# EAGLE design supply (EAGLE 7.2.0)
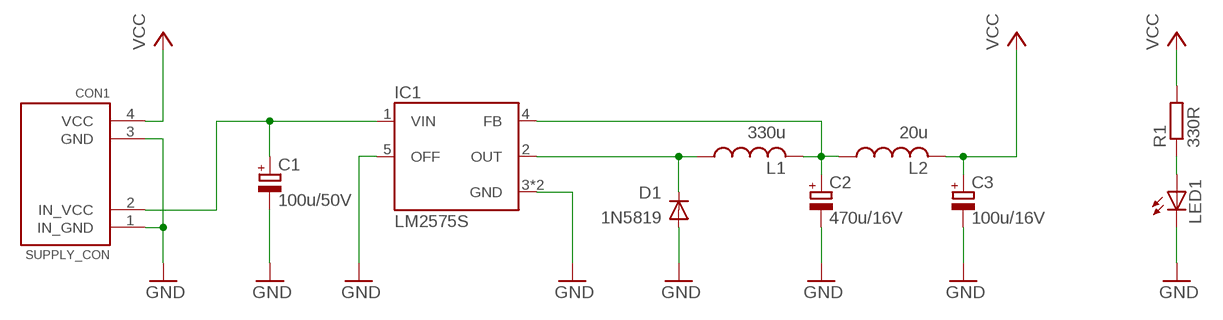
[diagram p0: schematic, sheet 1]

## Parts
C1  100u/50V  CPOL-EUE3.5-8  [E3,5-8]
C2  470u/16V  CPOL-EUE5-10.5  [E5-10,5]
C3  100u/16V  CPOL-EUE2.5-6  [E2,5-6]
CON1  SUPPLY_CON  [SUPPLY_CON]
D1  1N5819  1N4004  [DO41-10]
IC1  LM2575S  [TO263-5]
L1  330u  COIL  [COIL]
L2  20u  COIL  [COIL]
LED1  LEDSML1206  [SML1206]
R1  330R  R-EU_R0603  [R0603]

## Nets
GND: C1.- C2.- C3.- CON1.1(IN_GND) CON1.3(GND) D1.A IC1.3(GND) IC1.5(OFF) IC1.6(GND) LED1.C
IN_VCC: C1.+ CON1.2(IN_VCC) IC1.1(VIN)
N$1: C2.+ IC1.4(FB) L1.P$2 L2.P$1
N$3: LED1.A R1.1
N$6: D1.C IC1.2(OUT) L1.P$1
VCC: C3.+ CON1.4(VCC) L2.P$2 R1.2

## Library data of the parts
C1-C3 = rcl:CPOL-EU: POLARIZED CAPACITOR, European symbol
CON1 = supply connector:SUPPLY_CON
D1 = diode:1N4004: DIODE general purpose rectifier, 1 A
IC1 = v-reg-3:LM2575: National Semiconductor <http://www.national.com> 1.0A "Simple Switcher"(c) 52kHz, Vout 1.23-37V (HV: 57V), Vin 40V (HV: 60V), 50µA standby current
L1 L2 = coils:COIL
LED1 = led:LED: LED OSRAM: - CHIPLED LG R971, LG N971, LY N971, LG Q971, LY Q971, LO R971, LY R971 LH N974, LH R974 LS Q976, LO Q976, LY Q976 LO Q996 - Hyper CHIPLED LW Q18S LB Q993, LB Q99A, LB R99A - SideLED LS A670, LO A670, LY A670, LG A670, LP A670 LB A673, LV A673, LT A673, LW A673 LH A674 LY A675 LS A676, LA A676, LO A676, LY A676, LW A676 LS A679, LY A679, LG A679 - Hyper Micro SIDELED® LS Y876, LA Y876, LO Y876, LY Y876 LT Y87S - SmartLED LW L88C, LW L88S LB L89C, LB L89S, LG L890 LS L89K, LO L89K, LY L89K LS L896, LA L896, LO L896, LY L896 - TOPLED LS T670, LO T670, LY T670, LG T670, LP T670 LSG T670, LSP T670, LSY T670, LOP T670, LYG T670 LG T671, LOG T671, LSG T671 LB T673, LV T673, LT T673, LW T673 LH T674 LS T676, LA T676, LO T676, LY T676, LB T676, LH T676, LSB T676, LW T676 LB T67C, LV T67C, LT T67C, LS T67K, LO T67K, LY T67K, LW E67C LS E67B, LA E67B, LO E67B, LY E67B, LB E67C, LV E67C, LT E67C LW T67C LS T679, LY T679, LG T679 LS T770, LO T770, LY T770, LG T770, LP T770 LB T773, LV T773, LT T773, LW T773 LH T774 LS E675, LA E675, LY E675, LS T675 LS T776, LA T776, LO T776, LY T776, LB T776 LHGB T686 LT T68C, LB T68C - Hyper Mini TOPLED® LB M676 - Mini TOPLED Santana® LG M470 LS M47K, LO M47K, LY M47K Source: http://www.osram.convergy.de LUXEON: - LUMILED® LXK2-PW12-R00, LXK2-PW12-S00, LXK2-PW14-U00, LXK2-PW14-V00 LXK2-PM12-R00, LXK2-PM12-S00, LXK2-PM14-U00 LXK2-PE12-Q00, LXK2-PE12-R00, LXK2-PE12-S00, LXK2-PE14-T00, LXK2-PE14-U00 LXK2-PB12-K00, LXK2-PB12-L00, LXK2-PB12-M00, LXK2-PB14-N00, LXK2-PB14-P00, LXK2-PB14-Q00 LXK2-PR12-L00, LXK2-PR12-M00, LXK2-PR14-Q00, LXK2-PR14-R00 LXK2-PD12-Q00, LXK2-PD12-R00, LXK2-PD12-S00 LXK2-PH12-R00, LXK2-PH12-S00 LXK2-PL12-P00, LXK2-PL12-Q00, LXK2-PL12-R00 Source: www.luxeon.com KINGBRIGHT: KA-3528ASYC Source: www.kingbright.com
R1 = rcl:R-EU_: RESISTOR, European symbol

## Board
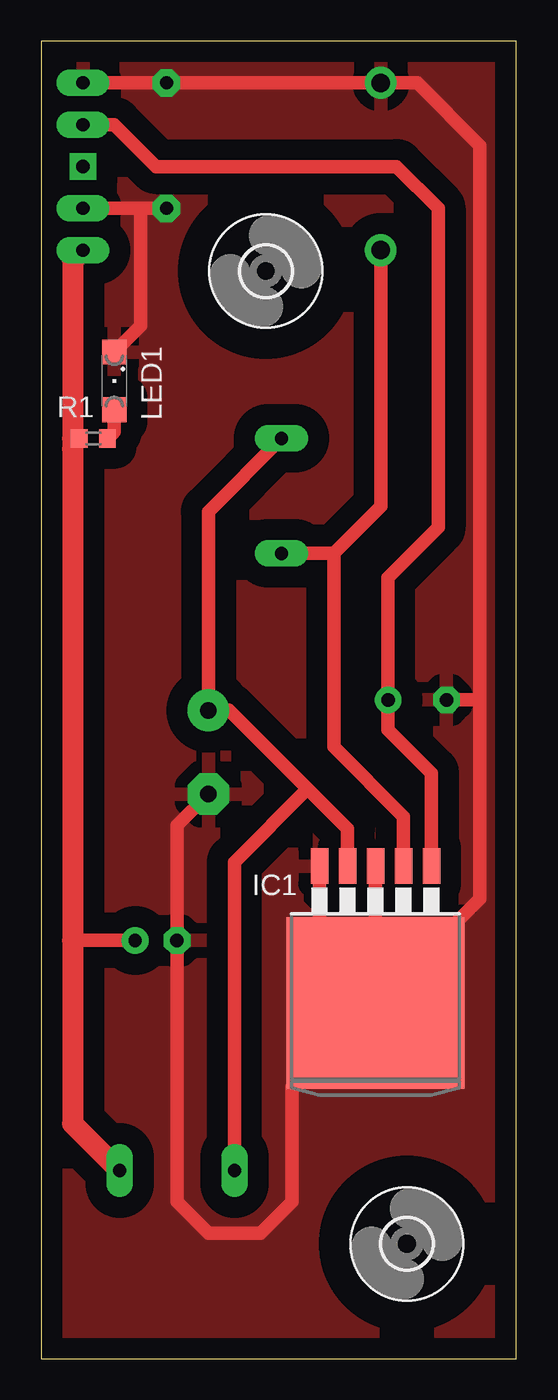
[diagram p1: board, top side]
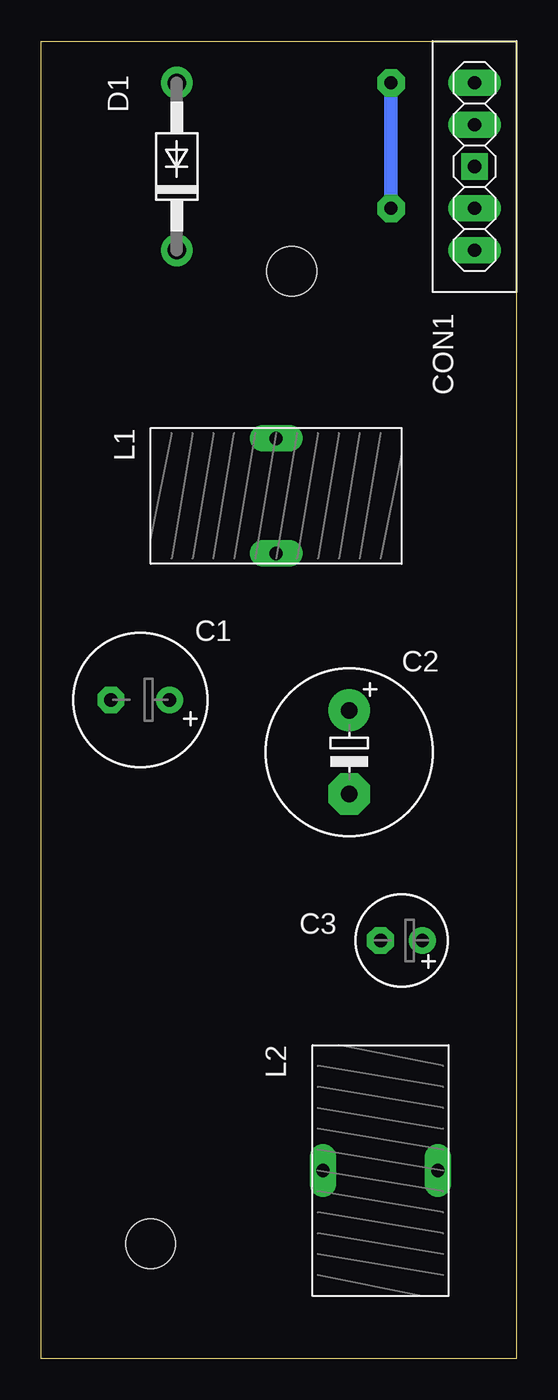
[diagram p2: board, bottom side, seen from below]

Size 28.88 x 80 mm. Coordinates in mm from the lower left corner, seen from the top.
Outline: 0,0 28.88,0 28.88,80 0,80 0,0
Copper layers (1*16): Top 0.035mm / dielectric 1.5mm / Bottom 0.035mm
Design rules "Aroidzap_DesignRules20mil": minimum track width 16mil, minimum drill 0.6mm, track to track 20mil, track to pad 20mil, pad to pad 20mil, via to via 20mil, smd to smd 16mil, copper to edge 20mil, drill to drill 40mil, minimum pad ring 16mil, minimum via ring 10mil, stop-mask expansion 4mil, vias tented up to drill 0mil, thermal gap 30mil

### Footprints (pad centres in the part's own frame; a part is rotated, then mirrored left to right if it is on the bottom)
E3,5-8 = drill 0.813 pad 1.6: + -1.778,0 | drill 0.813 pad 1.6 octagon: - 1.778,0
E5-10,5 = drill 1.016 pad 2.54: + -2.54,0 | drill 1.016 pad 2.54 octagon: - 2.54,0
E2,5-6 = drill 0.813 pad 1.6: + -1.27,0 | drill 0.813 pad 1.6 octagon: - 1.27,0
SUPPLY_CON = drill 0.8 long: 1 0,5.08; 2 0,2.54; 3 0,-2.54; 4 0,-5.08 | drill 0.8 square: NC 0,0
DO41-10 = drill 1.118: A 5.08,0; C -5.08,0
TO263-5 = smd 1.067 x 2.159: 1 -3.404,-5.791; 2 -1.702,-5.791; 3 0,-5.791; 4 1.702,-5.791; 5 3.404,-5.791 | smd 10.8 x 10.41: 6 0,2.54
COIL = drill 0.8 long: P$1 0,3.493; P$2 0,-3.493
SML1206 = smd 1.5 x 1.5: A 1.75,0; C -1.75,0
R0603 = smd 1 x 1.1: 1 -0.85,0; 2 0.85,0
3,0 = hole 3: 0,0

### Placement (x,y rotation side)
C1  22.86,40.01 180 bottom
C2  10.16,36.83 270 bottom
C3  6.99,25.4 180 bottom
CON1  2.54,72.39 0 bottom
D1  20.64,72.39 90 bottom
IC1  20.32,24.13 180 top
L1  14.61,52.39 180 bottom
L2  8.26,11.43 90 bottom
LED1  4.45,59.37 270 top
R1  3.17,55.88 180 top
U$1  [3,0]  13.65,66.04 0 top
U$2  [3,0]  22.23,6.99 0 top

### Tracks (layer width: path | path; a pad name or v marks a point on that pad's centre or on a via)
GND  (via drill 0.8 pad 1.68)
  Top 0.813: CON1.1 v7.62,77.47 D1.A 22.86,77.47 26.67,73.66 26.67,40.01 | 26.67,40.01 26.67,27.94 IC1.6 20.32,22.23 | C1.- 26.67,40.01 | IC1.3 20.32,22.23 | 20.32,22.23 16.92,25.63 IC1.5 16.92,18.19 15.24,16.51 15.24,9.53 13.34,7.62 10.16,7.62 8.26,9.53 C3.- 8.26,32.38 C2.- | v7.62,69.85 6.03,69.85 | 6.03,69.85 CON1.3 | 6.03,69.85 6.03,62.71 LED1.C
  Bottom 0.813: v7.62,77.47 v7.62,69.85
  pour Top (isolate 1.27): 29.21,80.01 0,80.01 0,0 29.21,0
  pour Top (isolate 1.27, no thermals): 15.24,27.94 16.51,26.67 27.3,26.67 27.3,13.34 13.97,13.34 13.97,27.94
IN_VCC
  Top 0.813: CON1.2 4.45,74.93 6.99,72.39 21.59,72.39 24.13,69.85 24.13,50.48 21.08,47.43 C1.+ 21.08,38.2 23.72,35.56 IC1.1
N$1
  Top 0.813: IC1.4 18.62,32.18 16.19,34.61 | 16.19,34.61 11.43,39.37 C2.+ 10.16,51.44 L1.P$2 | L2.P$1 11.75,30.16 16.19,34.61
N$3
  Top 0.813: R1.1 4.45,56.3 LED1.A
N$6
  Top 0.813: IC1.2 22.02,32.91 17.78,37.15 17.78,48.9 | D1.C 20.64,51.75 17.78,48.9 | L1.P$1 17.78,48.9
VCC
  Top 0.813: C3.+ 1.91,25.4 | 2.12,55.03 1.91,55.24 | R1.2 1.91,55.88
  Top 1.27: CON1.4 1.91,66.67 1.91,55.88 1.91,55.24 1.91,25.4 1.91,14.29 L2.P$2